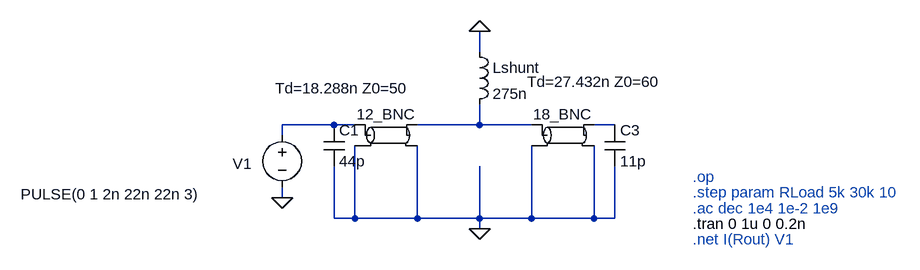
[diagram p0: schematic 3c_matched.asc]
3c_matched.asc, the LTspice schematic file:
Version 4
SHEET 1 1168 680
WIRE 496 320 496 288
WIRE 272 432 192 432
WIRE 304 432 272 432
WIRE 496 432 496 400
WIRE 496 432 400 432
WIRE 576 432 496 432
WIRE 704 432 672 432
WIRE 192 448 192 432
WIRE 192 544 192 528
WIRE 272 576 272 496
WIRE 304 576 304 464
WIRE 304 576 272 576
WIRE 400 576 400 464
WIRE 400 576 304 576
WIRE 496 576 496 496
WIRE 496 576 400 576
WIRE 576 576 576 464
WIRE 576 576 496 576
WIRE 672 576 672 464
WIRE 672 576 576 576
WIRE 704 576 704 496
WIRE 704 576 672 576
WIRE 496 592 496 576
FLAG 192 544 0
FLAG 496 592 0
FLAG 496 288 0
SYMBOL tline 352 448 R0
WINDOW 3 -67 -88 Top 2
SYMATTR Value Td=18.288n Z0=50
SYMATTR InstName 12_BNC
SYMBOL Voltage 192 432 R0
WINDOW 3 -402 107 Left 2
WINDOW 0 -76 60 Left 2
SYMATTR Value PULSE(0 1 2n 22n 22n 3)
SYMATTR InstName V1
SYMATTR SpiceLine Rser=50
SYMBOL tline 624 448 R0
WINDOW 3 49 -98 Top 2
SYMATTR Value Td=27.432n Z0=60
SYMATTR InstName 18_BNC
SYMBOL Cap 256 432 R0
SYMATTR InstName C1
SYMATTR Value 44p
SYMATTR SpiceLine Rser=3m
SYMBOL Cap 688 432 R0
SYMATTR InstName C3
SYMATTR Value 11p
SYMATTR SpiceLine Rser=2u Lser=2p
SYMBOL ind 480 304 R0
SYMATTR InstName Lshunt
SYMATTR Value 275n
SYMATTR SpiceLine Rser=0.43 Cpar=79p
TEXT 824 512 Left 2 ;.op
TEXT 824 536 Left 2 ;.step param RLoad 5k 30k 10
TEXT 824 560 Left 2 ;.ac dec 1e4 1e-2 1e9
TEXT 824 584 Left 2 !.tran 0 1u 0 0.2n
TEXT 824 608 Left 2 ;.net I(Rout) V1

The netlist it stands for:
* 3c_matched.asc
T§12_BNC N001 0 N002 0 Td=18.288n Z0=50
V1 N001 0 PULSE(0 1 2n 22n 22n 3) Rser=50
T§18_BNC N002 0 N003 0 Td=27.432n Z0=60
C1 N001 0 44p Rser=3m
C3 N003 0 11p Rser=2u Lser=2p
Lshunt 0 N002 275n Rser=0.43 Cpar=79p
* .op
* .step param RLoad 5k 30k 10
* .ac dec 1e4 1e-2 1e9
.tran 0 1u 0 0.2n
* .net I(Rout) V1
.backanno
.end